# Altium schematic sheet MC21R01_uC_ADC.SchDoc: MC21R01 Top Level
size A3; Author: AMP; DrawnBy: AMP; Organization: Altium Limited; Address1: 3 Minna Close; Address2: Belrose; Address3: NSW 2085; Address4: Australia; DocumentNumber: 0; Revision: 1.0; SheetNumber: 0; SheetTotal: 0
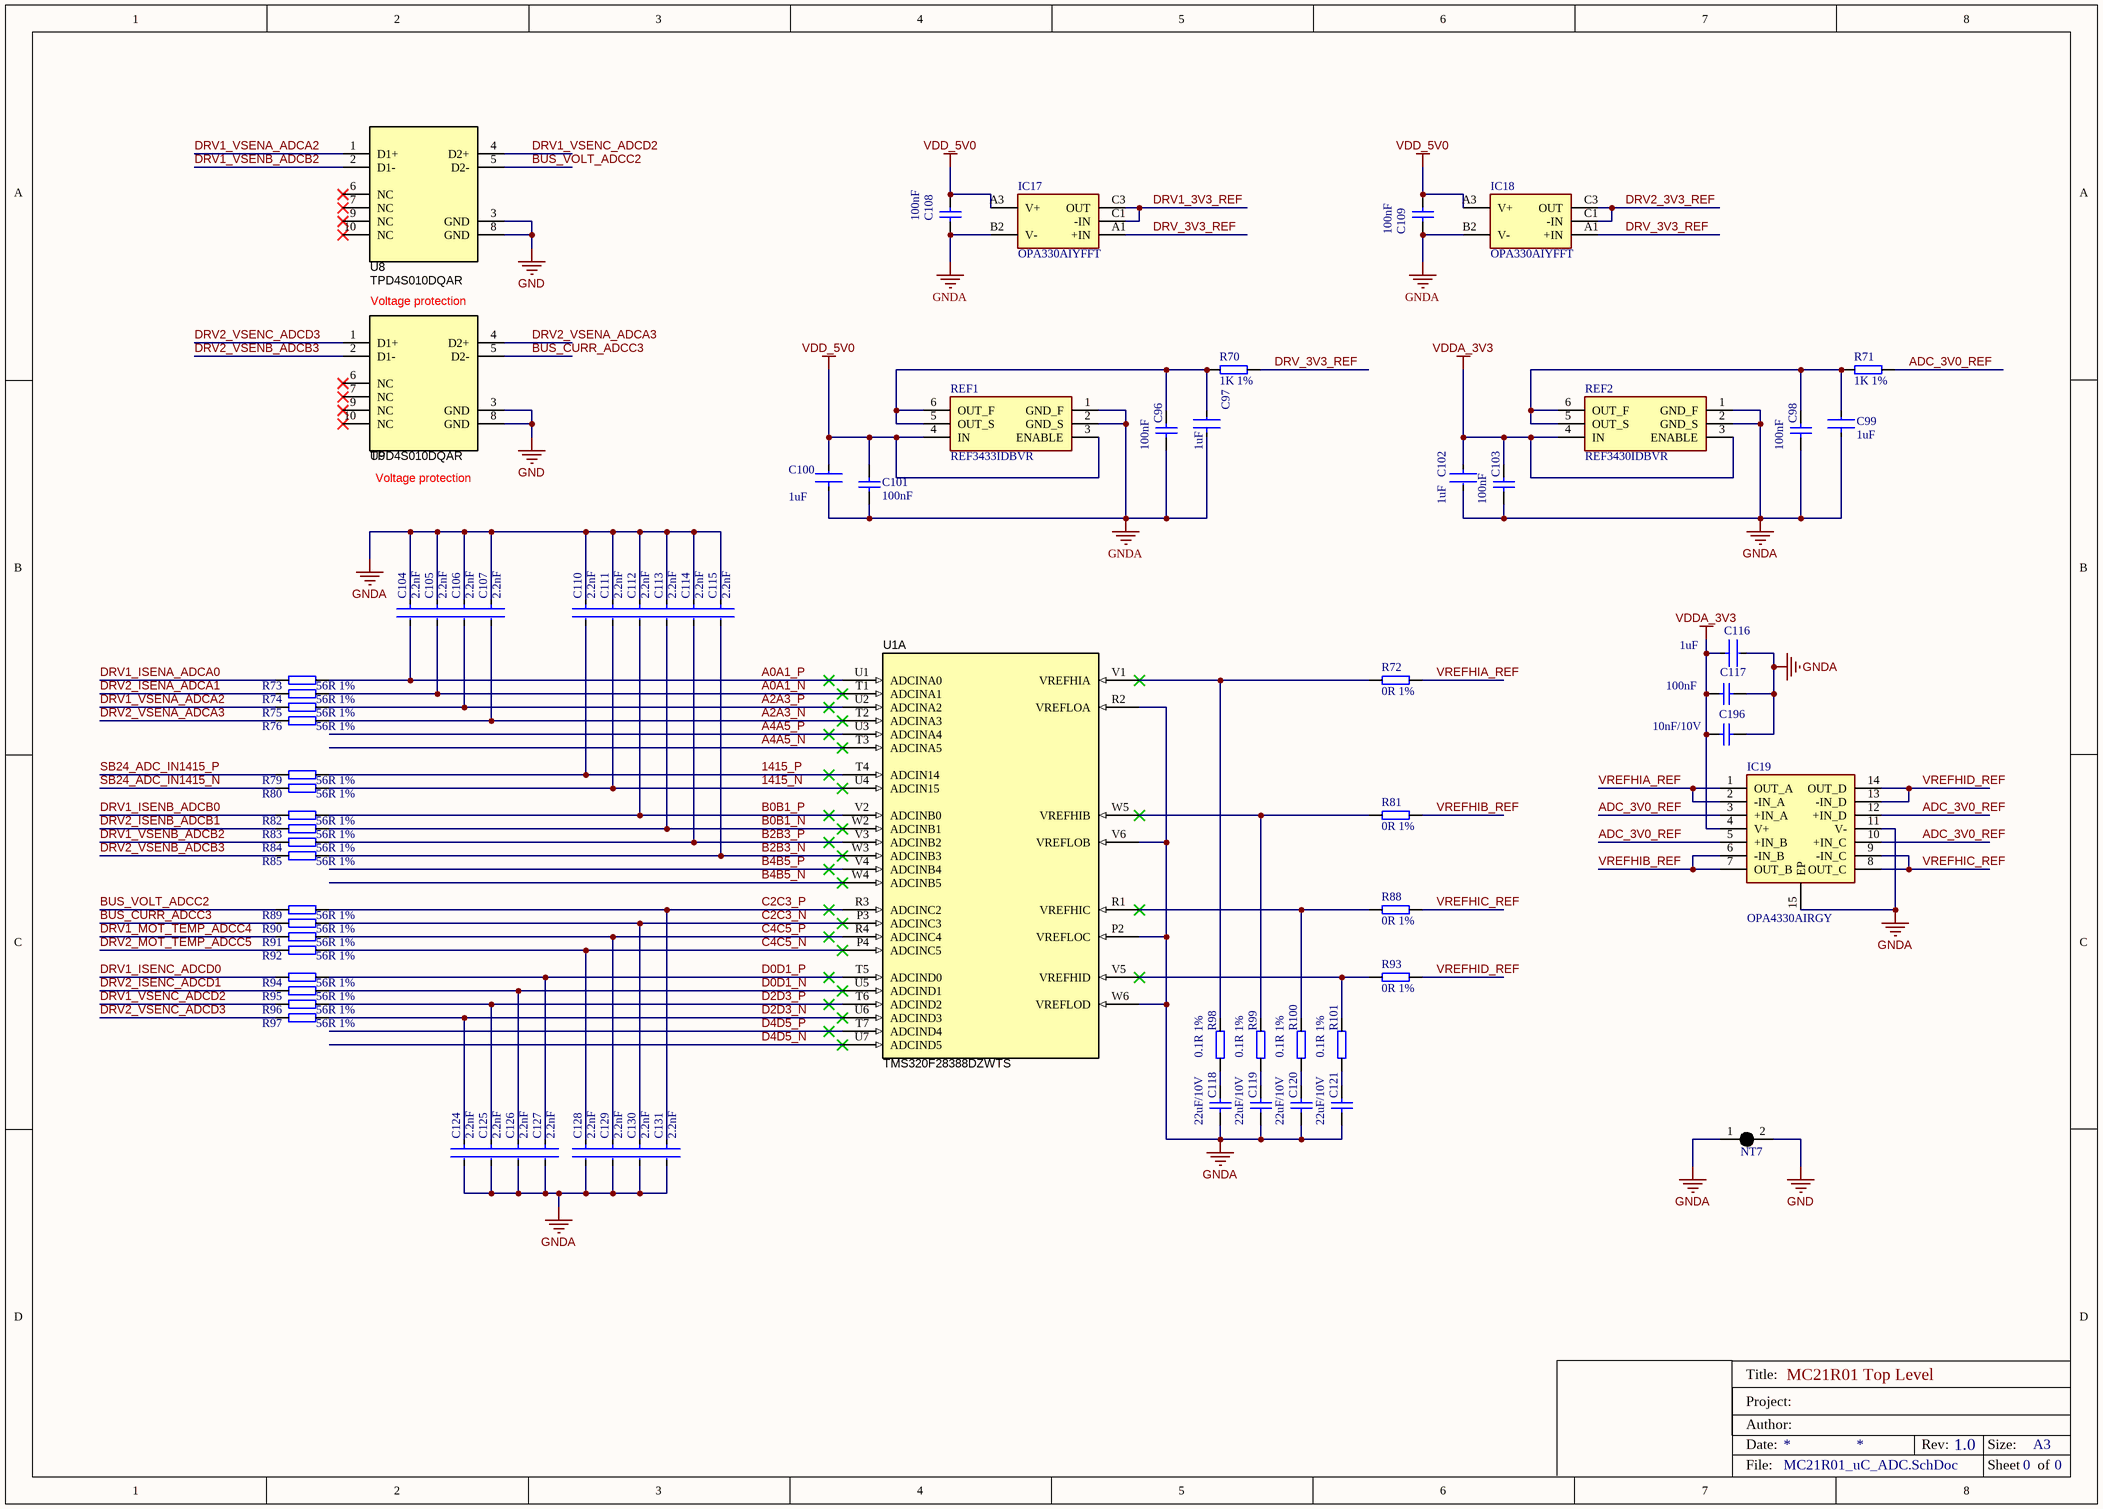
[diagram p0: MC21R01_uC_ADC.SchDoc]

## Parts
C96  value 100nF  [CAPC0603X03N]  (hidden comment: 100nF/25V 0201 10% X6S)
C97  Capacitance: 1uF  [FP-CL03-IPC_A]  (hidden comment: 1uF/6.3V 0201 10% X5R)
C98  value 100nF  [CAPC0603X03N]  (hidden comment: 100nF/25V 0201 10% X6S)
C99  Capacitance: 1uF  [FP-CL03-IPC_A]  (hidden comment: 1uF/6.3V 0201 10% X5R)
C100  Capacitance: 1uF  [FP-CL03-IPC_A]  (hidden comment: 1uF/6.3V 0201 10% X5R)
C101  value 100nF  [CAPC0603X03N]  (hidden comment: 100nF/25V 0201 10% X6S)
C102  Capacitance: 1uF  [FP-CL03-IPC_A]  (hidden comment: 1uF/6.3V 0201 10% X5R)
C103  value 100nF  [CAPC0603X03N]  (hidden comment: 100nF/25V 0201 10% X6S)
C104  Capacitance: 2.2nF  [FP-GRM033-0_03-IPC_A]  (hidden comment: 2200pF/50V 0201 10% X7R)
C105  Capacitance: 2.2nF  [FP-GRM033-0_03-IPC_A]  (hidden comment: 2200pF/50V 0201 10% X7R)
C106  Capacitance: 2.2nF  [FP-GRM033-0_03-IPC_A]  (hidden comment: 2200pF/50V 0201 10% X7R)
C107  Capacitance: 2.2nF  [FP-GRM033-0_03-IPC_A]  (hidden comment: 2200pF/50V 0201 10% X7R)
C108  value 100nF  [CAPC0603X03N]  (hidden comment: 100nF/25V 0201 10% X6S)
C109  value 100nF  [CAPC0603X03N]  (hidden comment: 100nF/25V 0201 10% X6S)
C110  Capacitance: 2.2nF  [FP-GRM033-0_03-IPC_A]  (hidden comment: 2200pF/50V 0201 10% X7R)
C111  Capacitance: 2.2nF  [FP-GRM033-0_03-IPC_A]  (hidden comment: 2200pF/50V 0201 10% X7R)
C112  Capacitance: 2.2nF  [FP-GRM033-0_03-IPC_A]  (hidden comment: 2200pF/50V 0201 10% X7R)
C113  Capacitance: 2.2nF  [FP-GRM033-0_03-IPC_A]  (hidden comment: 2200pF/50V 0201 10% X7R)
C114  Capacitance: 2.2nF  [FP-GRM033-0_03-IPC_A]  (hidden comment: 2200pF/50V 0201 10% X7R)
C115  Capacitance: 2.2nF  [FP-GRM033-0_03-IPC_A]  (hidden comment: 2200pF/50V 0201 10% X7R)
C116  Capacitance: 1uF  [FP-CL03-IPC_A]  (hidden comment: 1uF/6.3V 0201 10% X5R)
C117  value 100nF  [CAPC0603X03N]  (hidden comment: 100nF/25V 0201 10% X6S)
C118  value 22uF/10V  [0603 SMD capacitor]  (hidden comment: 22uF/10V 0603 20% X5R)
C119  value 22uF/10V  [0603 SMD capacitor]  (hidden comment: 22uF/10V 0603 20% X5R)
C120  value 22uF/10V  [0603 SMD capacitor]  (hidden comment: 22uF/10V 0603 20% X5R)
C121  value 22uF/10V  [0603 SMD capacitor]  (hidden comment: 22uF/10V 0603 20% X5R)
C124  Capacitance: 2.2nF  [FP-GRM033-0_03-IPC_A]  (hidden comment: 2200pF/50V 0201 10% X7R)
C125  Capacitance: 2.2nF  [FP-GRM033-0_03-IPC_A]  (hidden comment: 2200pF/50V 0201 10% X7R)
C126  Capacitance: 2.2nF  [FP-GRM033-0_03-IPC_A]  (hidden comment: 2200pF/50V 0201 10% X7R)
C127  Capacitance: 2.2nF  [FP-GRM033-0_03-IPC_A]  (hidden comment: 2200pF/50V 0201 10% X7R)
C128  Capacitance: 2.2nF  [FP-GRM033-0_03-IPC_A]  (hidden comment: 2200pF/50V 0201 10% X7R)
C129  Capacitance: 2.2nF  [FP-GRM033-0_03-IPC_A]  (hidden comment: 2200pF/50V 0201 10% X7R)
C130  Capacitance: 2.2nF  [FP-GRM033-0_03-IPC_A]  (hidden comment: 2200pF/50V 0201 10% X7R)
C131  Capacitance: 2.2nF  [FP-GRM033-0_03-IPC_A]  (hidden comment: 2200pF/50V 0201 10% X7R)
C196  value 10nF/10V  [0402 SMD Capacitor]  (hidden comment: 10nF/10V 0402 20% X5R)
IC17  OPA330AIYFFT  [OPA330 DSBGA]
IC18  OPA330AIYFFT  [OPA330 DSBGA]
IC19  OPA4330AIRGY  [OPA4330 RGY]
NT7  Net Tie SMD  [Net Tie SMD 0.4x0.8mm]  (value not drawn)  (net tie, no BOM)
R70  1K 1%  [0402 SMD rESISTOR]
R71  1K 1%  [0402 SMD rESISTOR]
R72  0R 1%  [0402 SMD rESISTOR]
R73  56R 1%  [0402 SMD rESISTOR]
R74  56R 1%  [0402 SMD rESISTOR]
R75  56R 1%  [0402 SMD rESISTOR]
R76  56R 1%  [0402 SMD rESISTOR]
R79  56R 1%  [0402 SMD rESISTOR]
R80  56R 1%  [0402 SMD rESISTOR]
R81  0R 1%  [0402 SMD rESISTOR]
R82  56R 1%  [0402 SMD rESISTOR]
R83  56R 1%  [0402 SMD rESISTOR]
R84  56R 1%  [0402 SMD rESISTOR]
R85  56R 1%  [0402 SMD rESISTOR]
R88  0R 1%  [0402 SMD rESISTOR]
R89  56R 1%  [0402 SMD rESISTOR]
R90  56R 1%  [0402 SMD rESISTOR]
R91  56R 1%  [0402 SMD rESISTOR]
R92  56R 1%  [0402 SMD rESISTOR]
R93  0R 1%  [0402 SMD rESISTOR]
R94  56R 1%  [0402 SMD rESISTOR]
R95  56R 1%  [0402 SMD rESISTOR]
R96  56R 1%  [0402 SMD rESISTOR]
R97  56R 1%  [0402 SMD rESISTOR]
R98  0.1R 1%  [0402 SMD rESISTOR]
R99  0.1R 1%  [0402 SMD rESISTOR]
R100  0.1R 1%  [0402 SMD rESISTOR]
R101  0.1R 1%  [0402 SMD rESISTOR]
REF1  REF3433IDBVR  [SOT95P280X145-6N]
REF2  REF3430IDBVR  [SOT95P280X145-6N]
U1  TMS320F28388DZWTS  [ZWT0337A]  (part A of 5)
U8  TPD4S010DQAR  [DQA0010A]
U9  TPD4S010DQAR  [DQA0010A]

## Nets
GND: NT7.2 U8.3(GND) U8.8(GND) U9.3(GND) U9.8(GND)
GNDA: C96.1 C97.1 C98.1 C99.1 C100.1 C101.1 C102.2 C103.1 C104.1 C105.1 C106.1 C107.1 C108.2 C109.2 C110.1 C111.1 C112.1 C113.1 C114.1 C115.1 C116.2 C117.1 C118.2 C119.2 C120.2 C121.2 C124.2 C125.2 C126.2 C127.2 C128.2 C129.2 C130.2 C131.2 C196.2 IC17.B2(V-) IC18.B2(V-) IC19.11(V-) IC19.15(EP) NT7.1 REF1.1(GND_F) REF1.2(GND_S) REF2.1(GND_F) REF2.2(GND_S) U1.P2(VREFLOC) U1.R2(VREFLOA) U1.V6(VREFLOB) U1.W6(VREFLOD)
VDD_5V0: C100.2 C101.2 C108.1 C109.1 IC17.A3(V+) IC18.A3(V+) REF1.3(ENABLE) REF1.4(IN)
VDDA_3V3: C102.1 C103.2 C116.1 C117.2 C196.1 IC19.4(V+) REF2.3(ENABLE) REF2.4(IN)
1415_N: C111.2 R80.1 U1.U4(ADCIN15)
1415_P: C110.2 R79.1 U1.T4(ADCIN14)
A0A1_N: C105.2 R74.1 U1.T1(ADCINA1)
A0A1_P: C104.2 R73.1 U1.U1(ADCINA0)
A2A3_N: C107.2 R76.1 U1.T2(ADCINA3)
A2A3_P: C106.2 R75.1 U1.U2(ADCINA2)
A4A5_N: U1.T3(ADCINA5)
A4A5_P: U1.U3(ADCINA4)
ADC_3V0_REF: IC19.3(+IN_A) IC19.5(+IN_B) IC19.10(+IN_C) IC19.12(+IN_D) R71.1
B0B1_N: C113.2 R83.1 U1.W2(ADCINB1)
B0B1_P: C112.2 R82.1 U1.V2(ADCINB0)
B2B3_N: C115.2 R85.1 U1.W3(ADCINB3)
B2B3_P: C114.2 R84.1 U1.V3(ADCINB2)
B4B5_N: U1.W4(ADCINB5)
B4B5_P: U1.V4(ADCINB4)
BUS_CURR_ADCC3: R90.2 U9.5(D2-)
BUS_VOLT_ADCC2: R89.2 U8.5(D2-)
C2C3_N: C130.1 R90.1 U1.P3(ADCINC3)
C2C3_P: C131.1 R89.1 U1.R3(ADCINC2)
C4C5_N: C128.1 R92.1 U1.P4(ADCINC5)
C4C5_P: C129.1 R91.1 U1.R4(ADCINC4)
D0D1_N: C126.1 R95.1 U1.U5(ADCIND1)
D0D1_P: C127.1 R94.1 U1.T5(ADCIND0)
D2D3_N: C124.1 R97.1 U1.U6(ADCIND3)
D2D3_P: C125.1 R96.1 U1.T6(ADCIND2)
D4D5_N: U1.U7(ADCIND5)
D4D5_P: U1.T7(ADCIND4)
DRV1_3V3_REF: IC17.C1(-IN) IC17.C3(OUT)
DRV1_ISENA_ADCA0: R73.2
DRV1_ISENB_ADCB0: R82.2
DRV1_ISENC_ADCD0: R94.2
DRV1_MOT_TEMP_ADCC4: R91.2
DRV1_VSENA_ADCA2: R75.2 U8.1(D1+)
DRV1_VSENB_ADCB2: R84.2 U8.2(D1-)
DRV1_VSENC_ADCD2: R96.2 U8.4(D2+)
DRV2_3V3_REF: IC18.C1(-IN) IC18.C3(OUT)
DRV2_ISENA_ADCA1: R74.2
DRV2_ISENB_ADCB1: R83.2
DRV2_ISENC_ADCD1: R95.2
DRV2_MOT_TEMP_ADCC5: R92.2
DRV2_VSENA_ADCA3: R76.2 U9.4(D2+)
DRV2_VSENB_ADCB3: R85.2 U9.2(D1-)
DRV2_VSENC_ADCD3: R97.2 U9.1(D1+)
DRV_3V3_REF: IC17.A1(+IN) IC18.A1(+IN) R70.1
SB24_ADC_IN1415_N: R80.2
SB24_ADC_IN1415_P: R79.2
VREFHIA_REF: IC19.1(OUT_A) IC19.2(-IN_A) R72.2
VREFHIB_REF: IC19.6(-IN_B) IC19.7(OUT_B) R81.2
VREFHIC_REF: IC19.8(OUT_C) IC19.9(-IN_C) R88.2
VREFHID_REF: IC19.13(-IN_D) IC19.14(OUT_D) R93.2
NetC96_2: C96.2 C97.2 R70.2 REF1.5(OUT_S) REF1.6(OUT_F)
NetC98_2: C98.2 C99.2 R71.2 REF2.5(OUT_S) REF2.6(OUT_F)
NetC118_1: C118.1 R98.1
NetC119_1: C119.1 R99.1
NetC120_1: C120.1 R100.1
NetC121_1: C121.1 R101.1
NetR72_1: R72.1 R98.2 U1.V1(VREFHIA)
NetR81_1: R81.1 R99.2 U1.W5(VREFHIB)
NetR88_1: R88.1 R100.2 U1.R1(VREFHIC)
NetR93_1: R93.1 R101.2 U1.V5(VREFHID)

Not connected (* = marked no-connect by the designer): U8 6(NC)* 7(NC)* 9(NC)* 10(NC)*; U9 6(NC)* 7(NC)* 9(NC)* 10(NC)*

## Notes on the sheet
- (near U9) Voltage protection
- Title:
- Date:
- Project:
- Author:
- Rev:
- Size:
- A3
- File:
- Sheet
- of

## Library data of the parts
C96 C98 C101 C103 C108 C109 C117 = CMP-001-00061-1: 100nF/25V 0201 10% Tolerance X6S Multilayer Ceramic Chip Capacitor; Populated: Yes; Provided by customer: No; Voltage Rating (DC): 25V; Capacitance: 100nF; Case/Package: 0201; Case Code (Imperial): 0201; Case Code (Metric): 0603; Dielectric: X6S; Height: 0.3mm; Length: 0.024inch; Max Operating Temperature: 105°C; Min Operating Temperature: -55°C; Mount: Surface Mount; Package Quantity: 15000; Packaging: Tape and Reel; Termination: SMD/SMT; Thickness: 0.013inch; Tolerance: 10%; Voltage Rating: 25V; Weight: 1.2E-05oz; Width: 0.3mm
C97 C99 C100 C102 C116 = CMP-13271-003873-1: 1uF/6.3V 0201 10% Tolerance X5R Multilayer Ceramic Chip Capacitor; Voltage Rating: 6.3V; Tolerance: 20%; Lead Free: Lead Free; Packaging: Tape and Reel; Dielectric: X5R; Case Code (Imperial): 0201; Max Operating Temperature: 85°C; Case/Package: 0201; Depth: 0.3mm; Width: 0.012inch; Thickness: 0.013inch; Length: 0.024inch; Case Code (Metric): 0603; Package Quantity: 1; Min Operating Temperature: -55°C; Mount: Surface Mount
C104-C107 C110-C115 C124-C131 = CMP-06035-000256-1: 2200pF/50V 0201 10% Tolerance X7R Multilayer Ceramic Chip Capacitor; Voltage Rating (DC): 25V; Depth: 0.3mm; Tolerance: 10%; Min Operating Temperature: -55°C; Max Operating Temperature: 125°C; Length: 0.6mm; Case Code (Metric): 0603; Width: 0.012inch; Height: 0.3mm; Case/Package: 0201; Mount: Surface Mount; Thickness: 0.013inch; Voltage Rating: 25V; Termination: SMD/SMT; Packaging: Tape and Reel; Package Quantity: 15000; Dielectric: X7R; Weight: 1.2E-05oz; Case Code (Imperial): 0201; Resistor Type: Ceramic
C118-C121 = 22uF/10V 0603 20% X5R: 22 uF 10 V 0603 ±20% Tolerance X5R Multilayer Ceramic Chip Capacitor; Manufacturer 1: Murata; Manufacturer Part Number 1: GRM188R60J106KE47D; Supplier 1: Farnell; Supplier Part Number 1: 2426957
C196 = 10nF/10V 0402 20% X5R: 10nF/10V 0402 20% Tolerance X5R Multilayer Ceramic Chip Capacitor; Manufacturer 1: KEMET; Manufacturer Part Number 1: C0402C103K8PACTU; Supplier Part Number 1: 2773069; Supplier 1: Farnell
IC17 IC18 = OPA330AIYFFT: 1 Channel op amp  0.25-μV/°C, 35-μA CMOS Operational Amplifiers Zero-Drift; Manufacturer_Name: Texas Instruments; Datasheet Link: http://www.ti.com/lit/gpn/opa330; Height: 1.45mm; Manufacturer_Part_Number: OPA330AIYFFT; Supplier Part Number 1: 595-OPA330AIYFFT; Mouser Price/Stock: https://www.mouser.co.uk/ProductDetail/Texas-Instruments/OPA330AIDBVT?qs=DS7Z8uEdLNxVoZWMB%2FsKAQ%3D%3D; RS Part Number: 8122619P; RS Price/Stock: http://uk.rs-online.com/web/p/products/8122619P; Supplier 1: Mouser
IC19 = OPA4330AIRGY: 4 Channel op amp  0.25-μV/°C, 35-μA CMOS Operational Amplifiers Zero-Drift; Manufacturer_Name: Texas Instruments; Manufacturer_Part_Number: OPA4330AIDR; Datasheet Link: http://www.ti.com/lit/gpn/opa4330; Height: 1.75mm; Supplier Part Number 1: 595-OPA4330AIRGYT; Mouser Price/Stock: https://www.mouser.co.uk/ProductDetail/Texas-Instruments/OPA4330AIDR?qs=EuM%2FBx4ov4R6DjwOW%252BMW9A%3D%3D; Supplier 1: Mouser
NT7 = Net Tie SMD: Net Tie starpoint
R70 R71 = 1K/50V 1% 0402 100mW: 1K/50V 1% 0402 100mW SMD Resistor; Manufacturer 1: Yageo; Manufacturer Part Number 1: RC0402FR-071KL; Supplier 1: Mouser; Supplier 2: Farnell; Supplier Part Number 2: 9239235; Supplier Part Number 1: 603-RC0402FR-071KL; Value: 1K
R72 R81 R88 R93 = 0R/50V 1% 0402 100mW: 0R/50V 1% 0402 100mW SMD Resistor; Manufacturer 1: Vishay; Manufacturer Part Number 1: CRCW04020000Z0ED; Supplier 1: Farnell; Supplier Part Number 1: 1469661; Value: 0R
R73-R76 R79 R80 R82-R85 R89-R92 R94-R97 = 56R/50V 1% 0402 100mW: 56R/50V 1% 0402 100mW SMD Resistor; Manufacturer 1: Vishay; Manufacturer Part Number 1: CRCW040256R0FKEDHP; Supplier 1: Farnell; Supplier Part Number 1: 1738833; Value: 56R
R98-R101 = 0.1R/50V 1% 0402 100mW: 0.1R/50V 1% 0402 100mW SMD Resistor; Manufacturer 1: Yageo; Manufacturer Part Number 1: RC0402FR-071KL; Supplier 1: Farnell; Supplier Part Number 1: 1284586; Value: 0.1R
REF1 = REF3433IDBVR: 3V3 Low-drift Low power Voltage reference 10ppm/ºC; Manufacturer_Name: Texas Instruments; Datasheet Link: http://www.ti.com/lit/gpn/ref3430; Height: 1.45mm; Manufacturer_Part_Number: REF3433IDBVR; Supplier Part Number 1: 595-REF3433IDBVR; Supplier 1: Mouser
REF2 = REF3430IDBVR: 3V Low-drift Low power Voltage reference 10ppm/ºC; Manufacturer_Name: Texas Instruments; Datasheet Link: http://www.ti.com/lit/gpn/ref3430; Height: 1.45mm; Manufacturer_Part_Number: REF3430IDBVR; Supplier Part Number 1: 595-REF3430IDBVR; Supplier 1: Mouser
U1 = TMS320F28388: TMS320F28388DZWTS, ZWT0337A (NFBGA-337); Manufacturer: Texas Instruments; SizeAreaWB_mm2: 324; SizeArea_mm2: 256; AEC Qualified: N; AEC Category: Q200; SizeZ_mm: 1.4; SizeY_mm: 16; CompType: IC; ComponentLink1Description: Datasheet Link; ComponentLink2Description: Product Folder; PackageReference: ZWT0337A; PackageDescription: NFBGA-337; ComponentLink2URL: http://www.ti.com/product/tms320f28388d; Alternate Manufacturer: Texas Instruments; ComponentLink3URL: http://www.ti.com/product/tms320f28388d/datasheet; ComponentLink1URL: http://www.ti.com/lit/ds/symlink/tms320f28388d.pdf; MountType: SMT; ComponentLink3Description: Online Datasheet; SizeX_mm: 16; PartNumber: TMS320F28388DZWTS
U8 U9 = TPD4S010DQAR: ESD Solution for High-Speed Differential Interface, 4 Channels, -40 to +85 degC,10-pin SON (DQA), Green (RoHS & no Sb/Br); Manufacturer: Texas Instruments; IO Leakage Current(nA): 10; IO Capacitance(Typ)(pF): 0.8; 1394 / Firewire: TRUE; Breakdown Voltage(Min)(V): 9; Differential Capacitance(pF): 0.05; IEC 61000-4-2 Contact(+/- kV): 8; ComponentLink1URL: http://www.ti.com/; PackageDescription: 10-Pin Plastic Small Outline No-Lead, 1 x 2.5 x 0.55 mm Body, 0.5 mm Pitch; ComponentLink2URL: http://www.ti.com/general/docs/lit/getliterature.tsp?genericPartNumber=TPD4S010&fileType=pdf; Serial ATA / eSATA: TRUE; ComponentLink3Description: URL Link1; Eco-Plan: Green (RoHS & no Sb/Br); ComponentLink2Description: Datasheet; ComponentLink3URL: SamplesURL:http://www.ti.com/product/tpd4s010#samples; PackageReference: DQA0010A; DatasheetVersion: SLVS817E; SubFamily: ESD Solution; PackageVersion: revB, Sep-2009; Mounting Technology: Surface Mount; ComponentLink1Description: Manufacturer URL; IEC 61000-4-2 Air-Gap(+/- kV): 9; PartNumber: TPD4S010DQAR